# Altium schematic sheet RTC.SchDoc
size A4; SheetNumber: 8; SheetTotal: 13
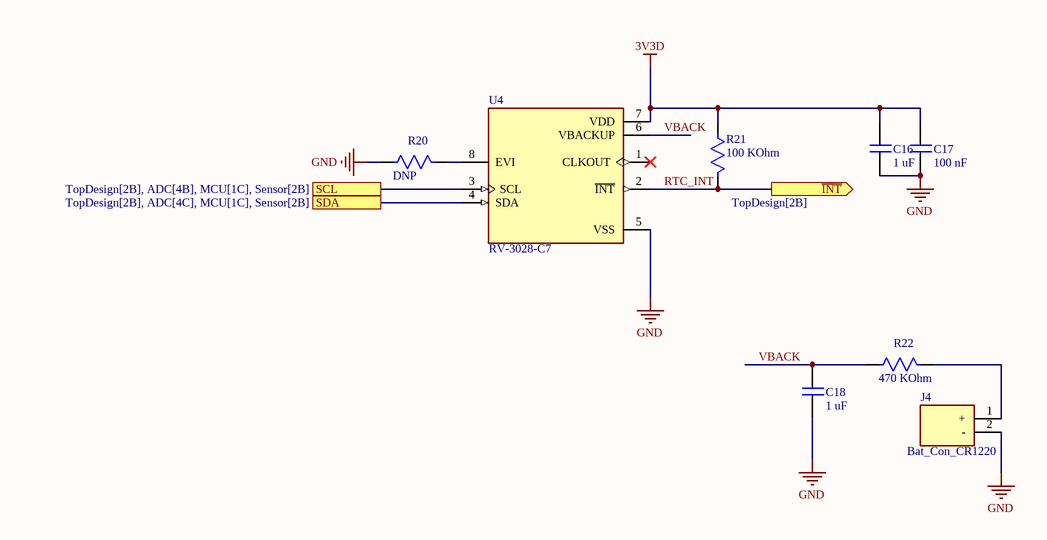
[diagram p0: RTC.SchDoc]

## Parts
C16  1 uF  [CAP_0603]
C17  100 nF  [CAP_0603]
C18  1 uF  [CAP_0603]
J4  Bat_Con_CR1220  [Bat_Con_CR1220]
R20  DNP  [RES_0402]
R21  100 KOhm  [Res_0603]
R22  470 KOhm  [Res_0603]
U4  RV-3028-C7  [IC_RV-3028-C7]

## Ports
SCL (see TopDesign[2B], ADC[4B], MCU[1C], Sensor[2B]), SDA (see TopDesign[2B], ADC[4C], MCU[1C], Sensor[2B]), ~{INT} (out, see TopDesign[2B])

## Nets
3V3D: C16.2 C17.2 R21.2 U4.7(VDD)
GND: C16.1 C17.1 C18.1 J4.2(-) R20.2 U4.5(VSS)
RTC_INT: R21.1 U4.2(~{INT}) ; port ~{INT}
SCL: U4.3(SCL) ; port SCL
SDA: U4.4(SDA) ; port SDA
VBACK: C18.2 R22.2 U4.6(VBACKUP)
NetJ4_1: J4.1(+) R22.1
NetR20_1: R20.1 U4.8(EVI)

Not connected (* = marked no-connect by the designer): U4 1(CLKOUT)*

## Library data of the parts
C16-C18 = Cap SMD: Cap SMD.
J4 = Bat_Con_CR1220: Connector; Manufacturer_Name: Harwin; Manufacturer_Part_Number: S8411-45R; Datasheet Link: https://cdn.harwin.com/pdfs/S8411R.pdf; Mouser Part Number: 855-S8411-45R; Mouser Price/Stock: https://www.mouser.co.uk/ProductDetail/Harwin/S8411-45R?qs=Qom7kyPojXY6B0JhnWxDgQ%3D%3D; LCSC: C969906
R20-R22 = Res smd: SMD Resistor; MP: RC0805FR-07330RL; MF: Yageo; Package: 2012 Rohm Semiconductor; Value: *; SnapEDA_Link: https://www.snapeda.com/parts/RC0805FR-07330RL/Yageo/view-part/106115/?ref=snap; Price: None; Availability: Unavailable
U4 = RV-3028-C7: Real Time Clock (RTC) IC Clock/Calendar 2B, 43B IÂ²C, 2-Wire Serial 8-WCDFN; MF: Micro Crystal; MFPN: RV-3028-C7 32.768KHZ 1PPM-TA-QA; SnapEDA_Link: https://www.snapeda.com/parts/RV-3028-C7%2032.768KHZ%201PPM-TA-QA/Micro+Crystal/view-part/?ref=snap; Package: SMD3215-8P; LCSC: C3304278